# Altium schematic sheet MOSFET.SchDoc
size A; SheetNumber: 5; SheetTotal: 6
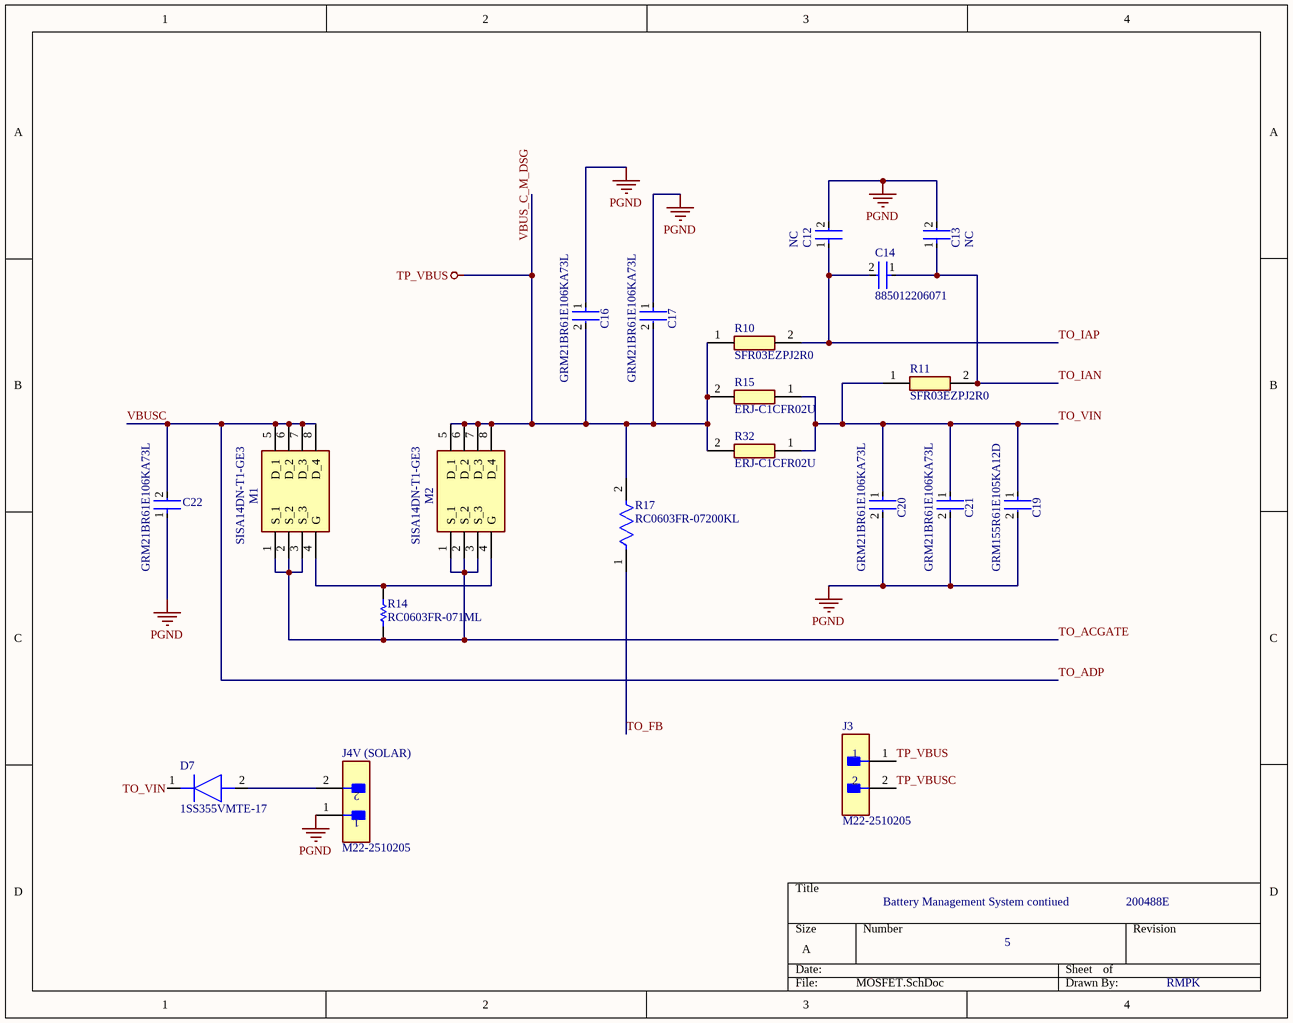
[diagram p0: MOSFET.SchDoc]

## Parts
C12  NC  [FP-885012206071-MFG]
C13  NC  [FP-885012206071-MFG]
C14  885012206071  [FP-885012206071-MFG]
C16  GRM21BR61E106KA73L  [FP-GRM21B-0_15-IPC_C]
C17  GRM21BR61E106KA73L  [FP-GRM21B-0_15-IPC_C]
C19  GRM155R61E105KA12D  [FP-GRM155-0_05-IPC_B]
C20  GRM21BR61E106KA73L  [FP-GRM21B-0_15-IPC_C]
C21  GRM21BR61E106KA73L  [FP-GRM21B-0_15-IPC_C]
C22  GRM21BR61E106KA73L  [FP-GRM21B-0_15-IPC_C]
D7  1SS355VMTE-17  [UDZVTE1722B]
J3  M22-2510205  [FP-M22-2510205-MFG]
J4V_(SOLAR)  M22-2510205  [FP-M22-2510205-MFG]
M1  SISA14DN-T1-GE3  [SQ7414AENT1GE3]
M2  SISA14DN-T1-GE3  [SQ7414AENT1GE3]
R10  SFR03EZPJ2R0  [RESC1608X55N]
R11  SFR03EZPJ2R0  [RESC1608X55N]
R14  RC0603FR-071ML  [RESC1608X55X25LL10T15]
R15  ERJ-C1CFR02U  [ERJC1]
R17  RC0603FR-07200KL  [FP-RC0603-0_55-IPC_B]
R32  ERJ-C1CFR02U  [ERJC1]

## Nets
PGND: C12.2 C13.2 C16.1 C17.1 C19.2 C20.2 C21.2 C22.1 J4V_(SOLAR).1
TP_VBUS: C16.2 C17.2 J3.1 M2.5(D_1) M2.6(D_2) M2.7(D_3) M2.8(D_4) R10.1 R15.2 R17.2 R32.2  [also labelled VBUS_C_M_DSG]
TO_ACGATE: M1.1(S_1) M1.2(S_2) M1.3(S_3) M2.1(S_1) M2.2(S_2) M2.3(S_3) R14.1
TO_ADP: C22.2 M1.5(D_1) M1.6(D_2) M1.7(D_3) M1.8(D_4)  [also labelled VBUSC]
TO_FB: R17.1
TO_IAN: C13.1 C14.1 R11.2
TO_IAP: C12.1 C14.2 R10.2
TO_VIN: C19.1 C20.1 C21.1 D7.1(K) R11.1 R15.1 R32.1
TP_VBUSC: J3.2
NetD7_2: D7.2(A) J4V_(SOLAR).2
NetM1_4: M1.4(G) M2.4(G) R14.2

## Notes on the sheet
- Battery Management System contiued
- 200488E
- 5
- RMPK

## Library data of the parts
C12-C14 = CMP-207839-000033-1: CAP CER 0.1UF 25V X7R 0603; Capacitance: 100nF; Tolerance: 10%; Case Code (Metric): 1608; Case/Package: 0603; Max Operating Temperature: 125°C; Dielectric: X7R; Voltage Rating: 25V; Min Operating Temperature: -55°C; Mount: Surface Mount; Voltage Rating (DC): 25V; Series: WCAP-CSGP; Packaging: Cut Tape; Case Code (Imperial): 0603; Thickness: 0.037inch; Width: 0.031inch; RoHS Compliant: Yes; Length: 0.063inch
C16 C17 C20-C22 = CMP-2007-03541-2: Chip Multilayer Ceramic Capacitors for General Purpose, 0805, 10uF, X5R, 15%, 10%, 25V; Length: 2mm; Depth: 1.25mm; Termination: SMD/SMT; Voltage: 25V; Height: 1.25mm; Material: Ceramic; Thickness: 0.053inch; Radiation Hardening: No; Min Operating Temperature: -55°C; Width: 0.049inch; Package Quantity: 1; Mount: Surface Mount; Dielectric: X5R; Packaging: Tape and Reel; Capacitance: 10uF; Voltage Rating (DC): 25V; Lead Free: Lead Free; Max Operating Temperature: 85°C; Case Code (Imperial): 0805; Case/Package: 0805; Tolerance: 10%; Voltage Rating: 25V; Case Code (Metric): 2012
C19 = CMP-2008-04581-2: Chip Multilayer Ceramic Capacitors for General Purpose, 0402, 1.0uF, X5R, 15%, 10%, 25V; Capacitance: 1uF; Height: 0.5mm; Voltage: 25V; Tolerance: 10%; Termination: SMD/SMT; Dielectric: X5R; REACH SVHC: No SVHC; Case Code (Imperial): 0402; Max Operating Temperature: 85°C; Lead Free: Lead Free; Case/Package: 0402; Mount: Surface Mount; Width: 0.5mm; Weight: 0.000212oz; Min Operating Temperature: -55°C; Voltage Rating (DC): 25V; Length: 1mm; Thickness: 0.022inch; Voltage Rating: 25V; Material: Ceramic; Case Code (Metric): 1005; Package Quantity: 10000; Packaging: Tape and Reel; Depth: 0.5mm
D7 = 1SS355VMTE-17: Diode; Manufacturer_Name: ROHM Semiconductor; Datasheet Link: https://datasheet.datasheetarchive.com/originals/distributors/Datasheets_SAMA/726503b2436a9ce4bc644e4966373f1b.pdf; Height: 0mm; Manufacturer_Part_Number: 1SS355VMTE-17; Mouser Part Number: 755-1SS355VMTE-17; Mouser Price/Stock: https://www.mouser.co.uk/ProductDetail/ROHM-Semiconductor/1SS355VMTE-17?qs=IsRgwgmxh693733hapxfjA%3D%3D
J3 J4V_(SOLAR) = CMP-15831-000005-1: CONN HEADER VERT 2POS 2MM; Manufacturer: Harwin; Conn Gender: Male; Current Rating: 2A; Number Of Contacts: 2; Conn Orientation: Vertical; Temperature Range Low: -40°C; Device Class L1: Connectors; ComponentLink2URL: https://cdn.harwin.com/pdfs/C018XX_M22_Series_Connectors.pdf; Temperature Range High: +105°C; Pitch: 2mm; Number Of Rows: 1; Temperature: -40°C to +105°C; Automotive: No; Device Class L3: unset; Octopart: https://octopart.com/m22-2510205-harwin-2538221; Mouser Description: Headers & Wire Housings 2 PIN SIL VERTICAL GOLD PIN HEADER; Height: 5.45mm; Category: Conn; Digikey Description: CONN HEADER VERT 2POS 2MM; Contact Material: Gold,Nickel; Lead Free: Yes; ComponentLink2Description: Datasheet; Manufacturer Part Number: M22-2510205; Device Class L2: Headers and Wire Housings; Package: 0; Footprint Url: https://cdn.harwin.com/pdfs/M22-251.pdf; RoHS: TRUE
M1 M2 = SISA14DN-T1-GE3: MOSFET (N-Channel); Manufacturer_Name: Vishay; Datasheet Link: https://www.vishay.com/docs/63252/sisa14dn.pdf; Manufacturer_Part_Number: SISA14DN-T1-GE3; Mouser Part Number: 78-SISA14DN-T1-GE3; Mouser Price/Stock: https://www.mouser.co.uk/ProductDetail/Vishay-Siliconix/SISA14DN-T1-GE3?qs=mtIy1uf5%252BARMEfEzOtCo6A%3D%3D; Arrow Part Number: SISA14DN-T1-GE3; Arrow Price/Stock: https://www.arrow.com/en/products/sisa14dn-t1-ge3/vishay?region=nac
R10 R11 = SFR03EZPJ2R0: Resistor; Manufacturer_Name: ROHM Semiconductor; Datasheet Link: https://www.mouser.com/datasheet/2/348/ROHM_S_A0009648217_1-2563033.pdf; Height: 0.55mm; Manufacturer_Part_Number: SFR03EZPJ2R0
R14 = CMP-1659-00056-1: Chip Resistor, 1 MOhm, +/- 1%, 100 mW, -55 to 155 degC, 0603 (1608 Metric), RoHS, Tape and Reel; Voltage Rating (DC): 25 V; Tolerance: 20%; Case\Package: Radial; Capacitance: 1 mF; Min Operating Temperature: -40 degC; PackageDescription: 2-Pin Surface Mount Device, Body 1.6 x 0.8 mm; ComponentLink1Description: Manufacturer URL; Radiation Hardening: No; DatasheetVersion: Rev. 4, 02/2016; REACH SVHC: No SVHC; Length: 20 mm; Max Operating Temperature: 85 degC; Diameter: 10 mm; Packaging: Bulk; Package Quantity: 200; PackageReference: 0603; Mount: Through Hole; ComponentLink1URL: http://www.yageo.com/; ComponentLink2URL: http://www.yageo.com/documents/recent/PYu-RC_Group_51_RoHS_L_04.pdf; ComponentLink2Description: Datasheet; Width: 0 inch; Lead Pitch: 5 mm; RoHSCompliant: true; Voltage Rating: 25 V; Height: 20 mm
R15 R32 = ERJ-C1CFR02U: Resistor; Manufacturer_Name: Panasonic; Datasheet Link: https://industrial.panasonic.com/cdbs/www-data/pdf/RDP0000/AOA0000C340.pdf; Height: 0.75mm; Manufacturer_Part_Number: ERJ-C1CFR02U; Mouser Part Number: 667-ERJ-C1CFR02U; Mouser Price/Stock: https://www.mouser.co.uk/ProductDetail/Panasonic/ERJ-C1CFR02U?qs=Z3CaLxJiOJL4jODaXLT4ow%3D%3D
R17 = CMP-03412-037786-1: RES SMD 200K OHM 1% 1/10W 0603; Temperature Coefficient: 100ppm/°C; Voltage Rating: 50V; Resistance: 200kR; Max Power Dissipation: 100mW; Packaging: Tape and Reel; REACH SVHC: No SVHC; Resistance Tolerance: 1%; Number of Pins: 2; Width: 0.031inch; Termination: SMD/SMT; Features: Moisture Resistant; Tolerance: 1%; Series: RC; Case Code (Imperial): 0603; Depth: 0.8mm; Number of Terminations: 2; Max Operating Temperature: 155°C; Resistor Type: Thick Film; Height: 0.022inch; Lead Free: Lead Free; Construction: Rectangular; Case/Package: 0603; Power Rating: 100mW; Case Code (Metric): 1608; Length: 1.6mm; Size Code: 0603; RoHS Compliant: Yes; Military Standard: Not; Min Operating Temperature: -55°C; Package Quantity: 1; Voltage Rating (DC): 50V